# EAGLE schematic electronic_load (EAGLE 7.3.0)

## Sheet 1 of 2
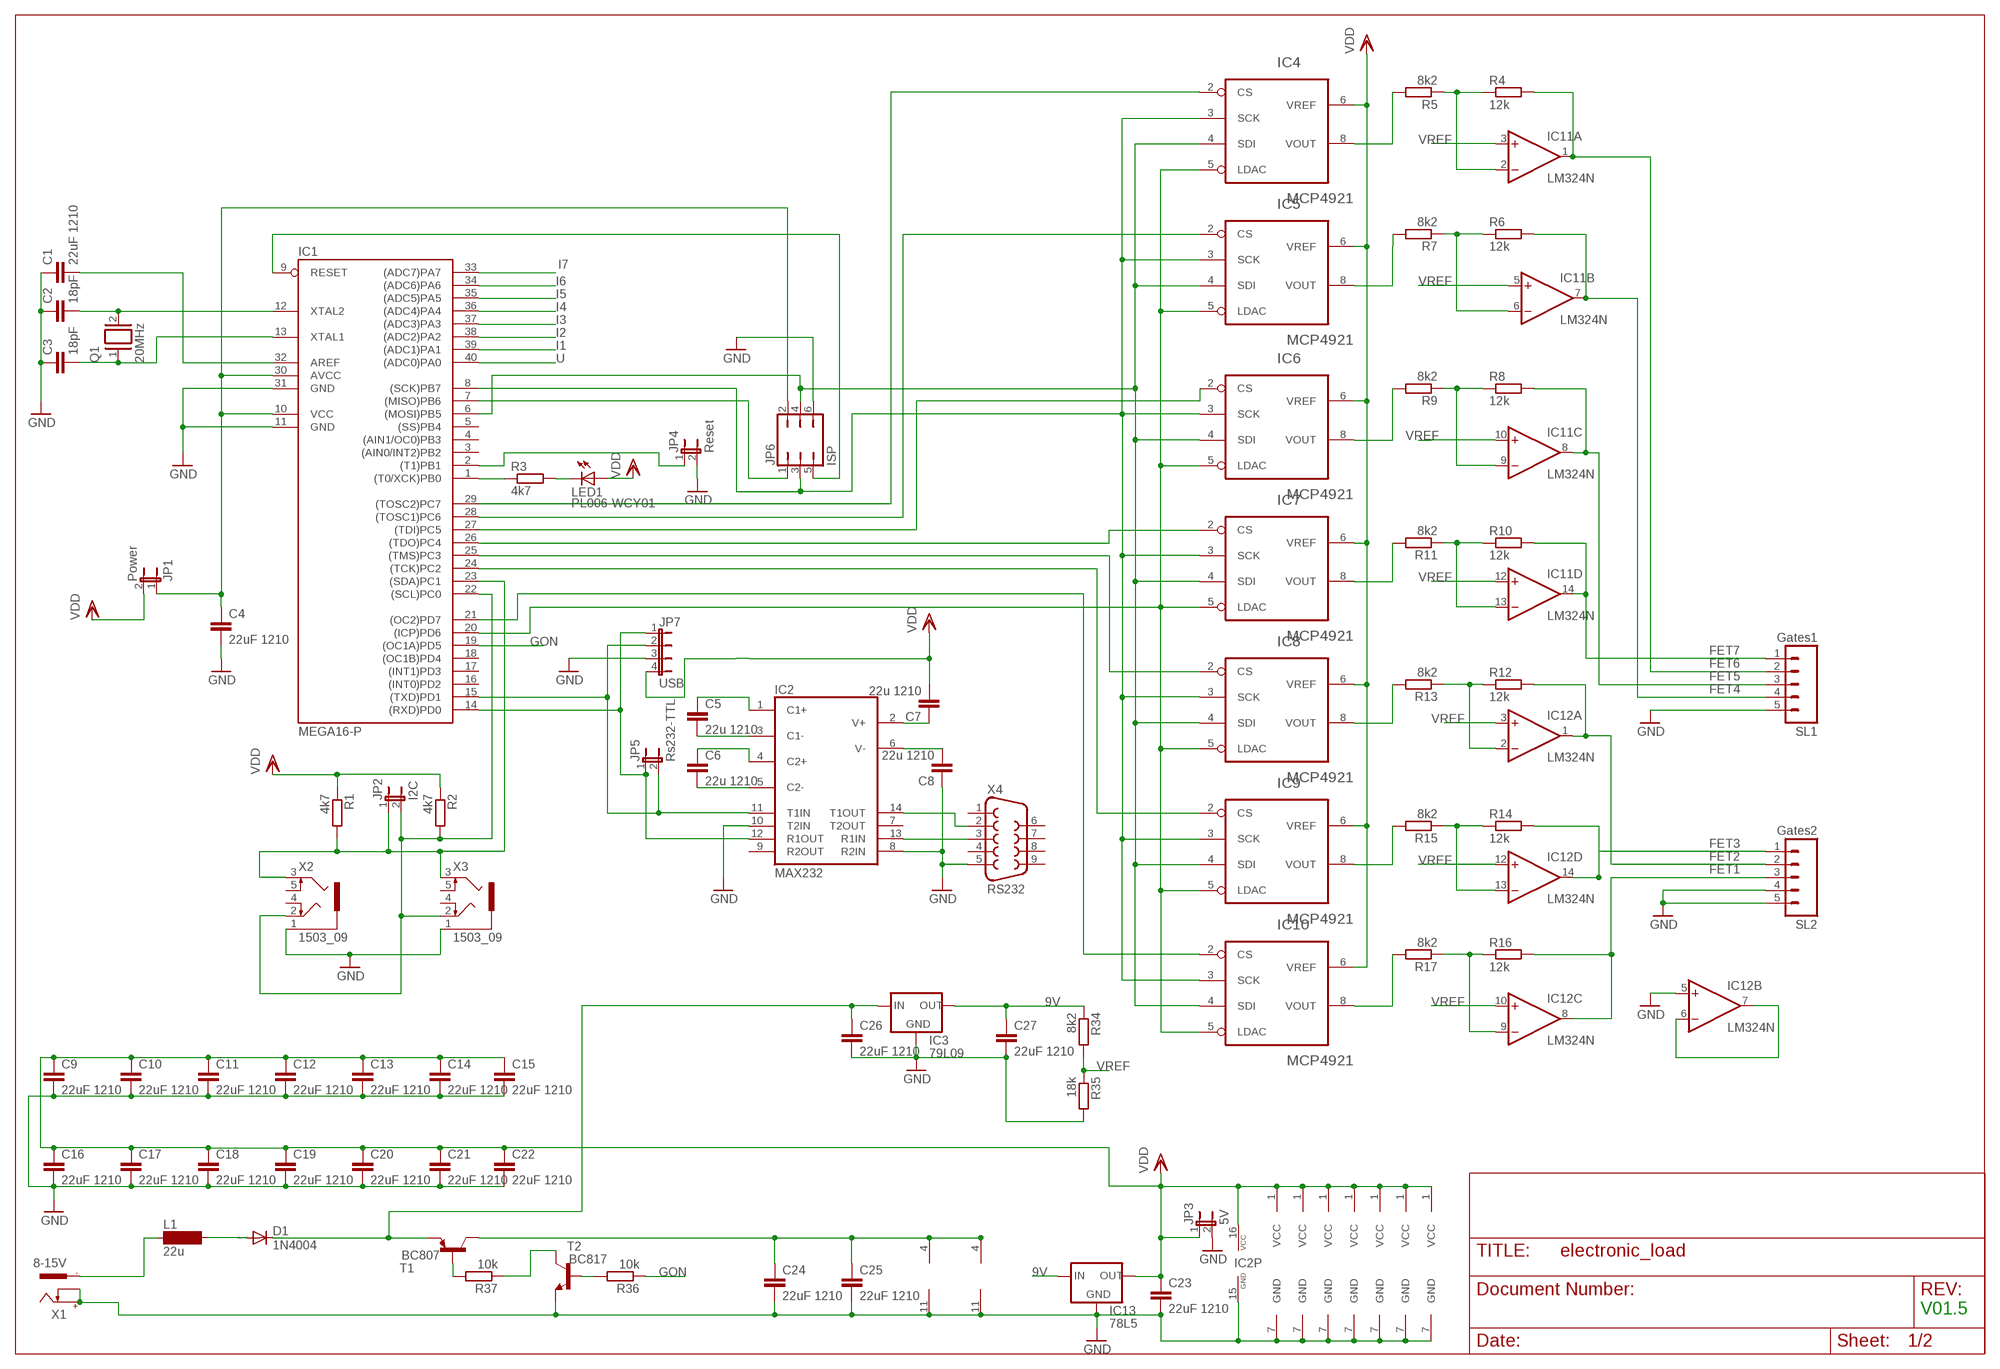
[diagram p0: schematic, sheet 1]

### Parts
C1  22uF 1210  C-EUC1206  [C1206]
C2  18pF  C-EU025-025X050  [C025-025X050]
C3  18pF  C-EU025-025X050  [C025-025X050]
C4  22uF 1210  C-EUC1206  [C1206]
C5  22u 1210  C-EUC1206  [C1206]
C6  22u 1210  C-EUC1206  [C1206]
C7  22u 1210  C-EUC1206  [C1206]
C8  22u 1210  C-EUC1206  [C1206]
C9  22uF 1210  C-EUC1206  [C1206]
C10  22uF 1210  C-EUC1206  [C1206]
C11  22uF 1210  C-EUC1206  [C1206]
C12  22uF 1210  C-EUC1206  [C1206]
C13  22uF 1210  C-EUC1206  [C1206]
C14  22uF 1210  C-EUC1206  [C1206]
C15  22uF 1210  C-EUC1206  [C1206]
C16  22uF 1210  C-EUC1206  [C1206]
C17  22uF 1210  C-EUC1206  [C1206]
C18  22uF 1210  C-EUC1206  [C1206]
C19  22uF 1210  C-EUC1206  [C1206]
C20  22uF 1210  C-EUC1206  [C1206]
C21  22uF 1210  C-EUC1206  [C1206]
C22  22uF 1210  C-EUC1206  [C1206]
C23  22uF 1210  C-EUC1206  [C1206]
C24  22uF 1210  C-EUC1206  [C1206]
C25  22uF 1210  C-EUC1206  [C1206]
C26  22uF 1210  C-EUC1206  [C1206]
C27  22uF 1210  C-EUC1206  [C1206]
D1  1N4004  [DO41-10]
IC1  MEGA16-P  [DIL40]
IC2  MAX232  [DIL16]
IC3  79L09  78LXX  [78LXX]
IC4  MCP4921  MCP491  [DIL08]
IC5  MCP4921  MCP491  [DIL08]
IC6  MCP4921  MCP491  [DIL08]
IC7  MCP4921  MCP491  [DIL08]
IC8  MCP4921  MCP491  [DIL08]
IC9  MCP4921  MCP491  [DIL08]
IC10  MCP4921  MCP491  [DIL08]
IC11  LM324N  [DIL14]
IC12  LM324N  [DIL14]
IC13  78L5  78LXX  [78LXX]
JP1  Power  JP1E  [JP1]
JP2  I2C  JP1E  [JP1]
JP3  5V  JP1E  [JP1]
JP4  Reset  JP1E  [JP1]
JP5  Rs232-TTL  JP1E  [JP1]
JP6  ISP  JP3Q  [JP3Q]
JP7  USB  JP4E  [JP4]
L1  22u  MS85  [MS85]
LED1  PL006-WCY01  [SOT23]
Q1  20MHz  XTAL/S  [QS]
R1  4k7  R-EU_0207/2V  [0207/2V]
R2  4k7  R-EU_0207/2V  [0207/2V]
R3  4k7  R-EU_R1206  [R1206]
R4  12k  R-EU_R1206  [R1206]
R5  8k2  R-EU_R1206  [R1206]
R6  12k  R-EU_R1206  [R1206]
R7  8k2  R-EU_R1206  [R1206]
R8  12k  R-EU_R1206  [R1206]
R9  8k2  R-EU_R1206  [R1206]
R10  12k  R-EU_R1206  [R1206]
R11  8k2  R-EU_R1206  [R1206]
R12  12k  R-EU_R1206  [R1206]
R13  8k2  R-EU_R1206  [R1206]
R14  12k  R-EU_R1206  [R1206]
R15  8k2  R-EU_R1206  [R1206]
R16  12k  R-EU_R1206  [R1206]
R17  8k2  R-EU_R1206  [R1206]
R34  8k2  R-EU_R1206  [R1206]
R35  18k  R-EU_R1206  [R1206]
R36  10k  R-EU_R1206  [R1206]
R37  10k  R-EU_R1206  [R1206]
SL1  Gates1  M05  [05P]
SL2  Gates2  M05  [05P]
T1  BC807  BC807-16-PNP-SOT23-BEC  [SOT23-BEC]
T2  BC817  BC817-16-NPN-SOT23-BEC  [SOT23-BEC]
X1  8-15V  737992-55  [737992-5]
X2  1503_09  [1503_09]
X3  1503_09  [1503_09]
X4  RS232  F09H  [F09H]

### Nets
9V: C27.1 IC3.OUT IC13.IN R34.1
C13: C5.1 IC2.1(C1+)
FET1: IC12.8(C:OUT) R16.2 SL2.3
FET2: IC12.1(A:OUT) R12.2 SL2.2
FET3: IC12.14(D:OUT) R14.2 SL2.1
FET4: IC11.7(B:OUT) R6.2 SL1.4
FET5: IC11.8(C:OUT) R8.2 SL1.3
FET6: IC11.1(A:OUT) R4.2 SL1.2
FET7: IC11.14(D:OUT) R10.2 SL1.1
GND: C1.1 C2.1 C3.1 C4.2 C8.1 C9.2 C10.2 C11.2 C12.2 C13.2 C14.2 C15.2 C16.2 C17.2 C18.2 C19.2 C20.2 C21.2 C22.2 C23.2 C24.2 C25.2 C26.2 C27.2 IC1.11(GND) IC1.31(GND) IC2.8(R2IN) IC2.10(T2IN) IC2.15(GND) IC3.GND IC4.7(GND) IC5.7(GND) IC6.7(GND) IC7.7(GND) IC8.7(GND) IC9.7(GND) IC10.7(GND) IC11.11(P:V-) IC12.5(B:+IN) IC12.11(P:V-) IC13.GND JP3.2 JP4.2 JP6.6 JP7.3 R35.2 SL1.5 SL2.4 SL2.5 T2.E X1.+ X1.K X2.1 X3.1 X4.5 ; also sheet 2
GON: IC1.19((OC1A)PD5) R36.1
I1: IC1.39((ADC1)PA1) ; also sheet 2
I2: IC1.38((ADC2)PA2) ; also sheet 2
I3: IC1.37((ADC3)PA3) ; also sheet 2
I4: IC1.36((ADC4)PA4) ; also sheet 2
I5: IC1.35((ADC5)PA5) ; also sheet 2
I6: IC1.34((ADC6)PA6) ; also sheet 2
I7: IC1.33((ADC7)PA7) ; also sheet 2
N$2: IC1.14((RXD)PD0) IC2.12(R1OUT) JP5.1 JP7.1
N$3: C6.2 IC2.5(C2-)
N$4: IC1.21((OC2)PD7) IC10.2(CS)
N$5: IC1.23((SDA)PC1) JP2.1 R1.2 X2.3 X3.3
N$6: IC1.15((TXD)PD1) IC2.11(T1IN) JP5.2 JP7.2
N$7: L1.1 X1.-1
N$8: IC1.24((TCK)PC2) IC9.2(CS)
N$9: IC2.13(R1IN) X4.3
N$10: IC6.8(VOUT) R9.2
N$11: IC1.20((ICP)PD6) IC4.5(LDAC) IC5.5(LDAC) IC6.5(LDAC) IC7.5(LDAC) IC8.5(LDAC) IC9.5(LDAC) IC10.5(LDAC)
N$12: D1.A L1.2
N$13: C6.1 IC2.4(C2+)
N$14: C5.2 IC2.3(C1-)
N$15: IC1.7((MISO)PB6) JP6.1
N$16: C7.1 IC2.2(V+)
N$17: C8.2 IC2.6(V-)
N$18: IC1.9(RESET) JP6.5
N$19: C2.2 IC1.12(XTAL2) Q1.2
N$20: IC1.6((MOSI)PB5) IC4.4(SDI) IC5.4(SDI) IC6.4(SDI) IC7.4(SDI) IC8.4(SDI) IC9.4(SDI) IC10.4(SDI) JP6.4
N$21: IC7.8(VOUT) R11.2
N$22: IC1.22((SCL)PC0) JP2.2 R2.2 X2.2 X3.2
N$23: IC1.25((TMS)PC3) IC8.2(CS)
N$24: IC8.8(VOUT) R13.2
N$25: C4.1 IC1.10(VCC) IC1.30(AVCC) JP1.1 JP6.2
N$26: IC9.8(VOUT) R15.2
N$28: IC1.8((SCK)PB7) IC4.3(SCK) IC5.3(SCK) IC6.3(SCK) IC7.3(SCK) IC8.3(SCK) IC9.3(SCK) IC10.3(SCK) JP6.3
N$31: IC4.8(VOUT) R5.2
N$33: IC2.14(T1OUT) X4.2
N$35: C1.2 IC1.32(AREF)
N$36: IC11.13(D:-IN) R10.1 R11.1
N$37: C3.2 IC1.13(XTAL1) Q1.1
N$38: IC11.9(C:-IN) R8.1 R9.1
N$39: IC10.8(VOUT) R17.2
N$40: IC12.13(D:-IN) R14.1 R15.1
N$42: IC1.1((T0/XCK)PB0) R3.1
N$43: LED1.3(C) R3.2
N$46: IC1.2((T1)PB1) JP4.1
N$50: IC1.29((TOSC2)PC7) IC4.2(CS)
N$51: IC1.26((TDO)PC4) IC7.2(CS)
N$55: IC5.8(VOUT) R7.2
N$56: C26.1 D1.C IC3.IN T1.E
N$57: IC12.2(A:-IN) R12.1 R13.1
N$58: IC12.9(C:-IN) R16.1 R17.1
N$59: C24.1 C25.1 IC11.4(P:V+) IC12.4(P:V+) T1.C
N$61: R37.2 T1.B
N$62: IC1.28((TOSC1)PC6) IC5.2(CS)
N$63: R37.1 T2.C
N$64: R36.2 T2.B
N$71: IC1.27((TDI)PC5) IC6.2(CS)
N$73: IC11.6(B:-IN) R6.1 R7.1
N$91: IC11.2(A:-IN) R4.1 R5.1
N$96: IC12.6(B:-IN) IC12.7(B:OUT)
U: IC1.40((ADC0)PA0) ; also sheet 2
VDD: C7.2 C9.1 C10.1 C11.1 C12.1 C13.1 C14.1 C15.1 C16.1 C17.1 C18.1 C19.1 C20.1 C21.1 C22.1 C23.1 IC2.16(VCC) IC4.1(VCC) IC4.6(VREF) IC5.1(VCC) IC5.6(VREF) IC6.1(VCC) IC6.6(VREF) IC7.1(VCC) IC7.6(VREF) IC8.1(VCC) IC8.6(VREF) IC9.1(VCC) IC9.6(VREF) IC10.1(VCC) IC10.6(VREF) IC13.OUT JP1.2 JP3.1 JP7.4 LED1.1(A) R1.1 R2.1 ; also sheet 2
VREF: IC11.3(A:+IN) IC11.5(B:+IN) IC11.10(C:+IN) IC11.12(D:+IN) IC12.3(A:+IN) IC12.10(C:+IN) IC12.12(D:+IN) R34.2 R35.1
Unconnected: IC1.3((AIN0/INT2)PB2) IC1.4((AIN1/OC0)PB3) IC1.5((SS)PB4) IC1.16((INT0)PD2) IC1.17((INT1)PD3) IC1.18((OC1B)PD4) IC2.7(T2OUT) IC2.9(R2OUT) X1.-2 X2.4 X2.5 X3.4 X3.5 X4.1 X4.4 X4.6 X4.7 X4.8 X4.9

### Notes on the sheet
- V01.5

## Sheet 2 of 2
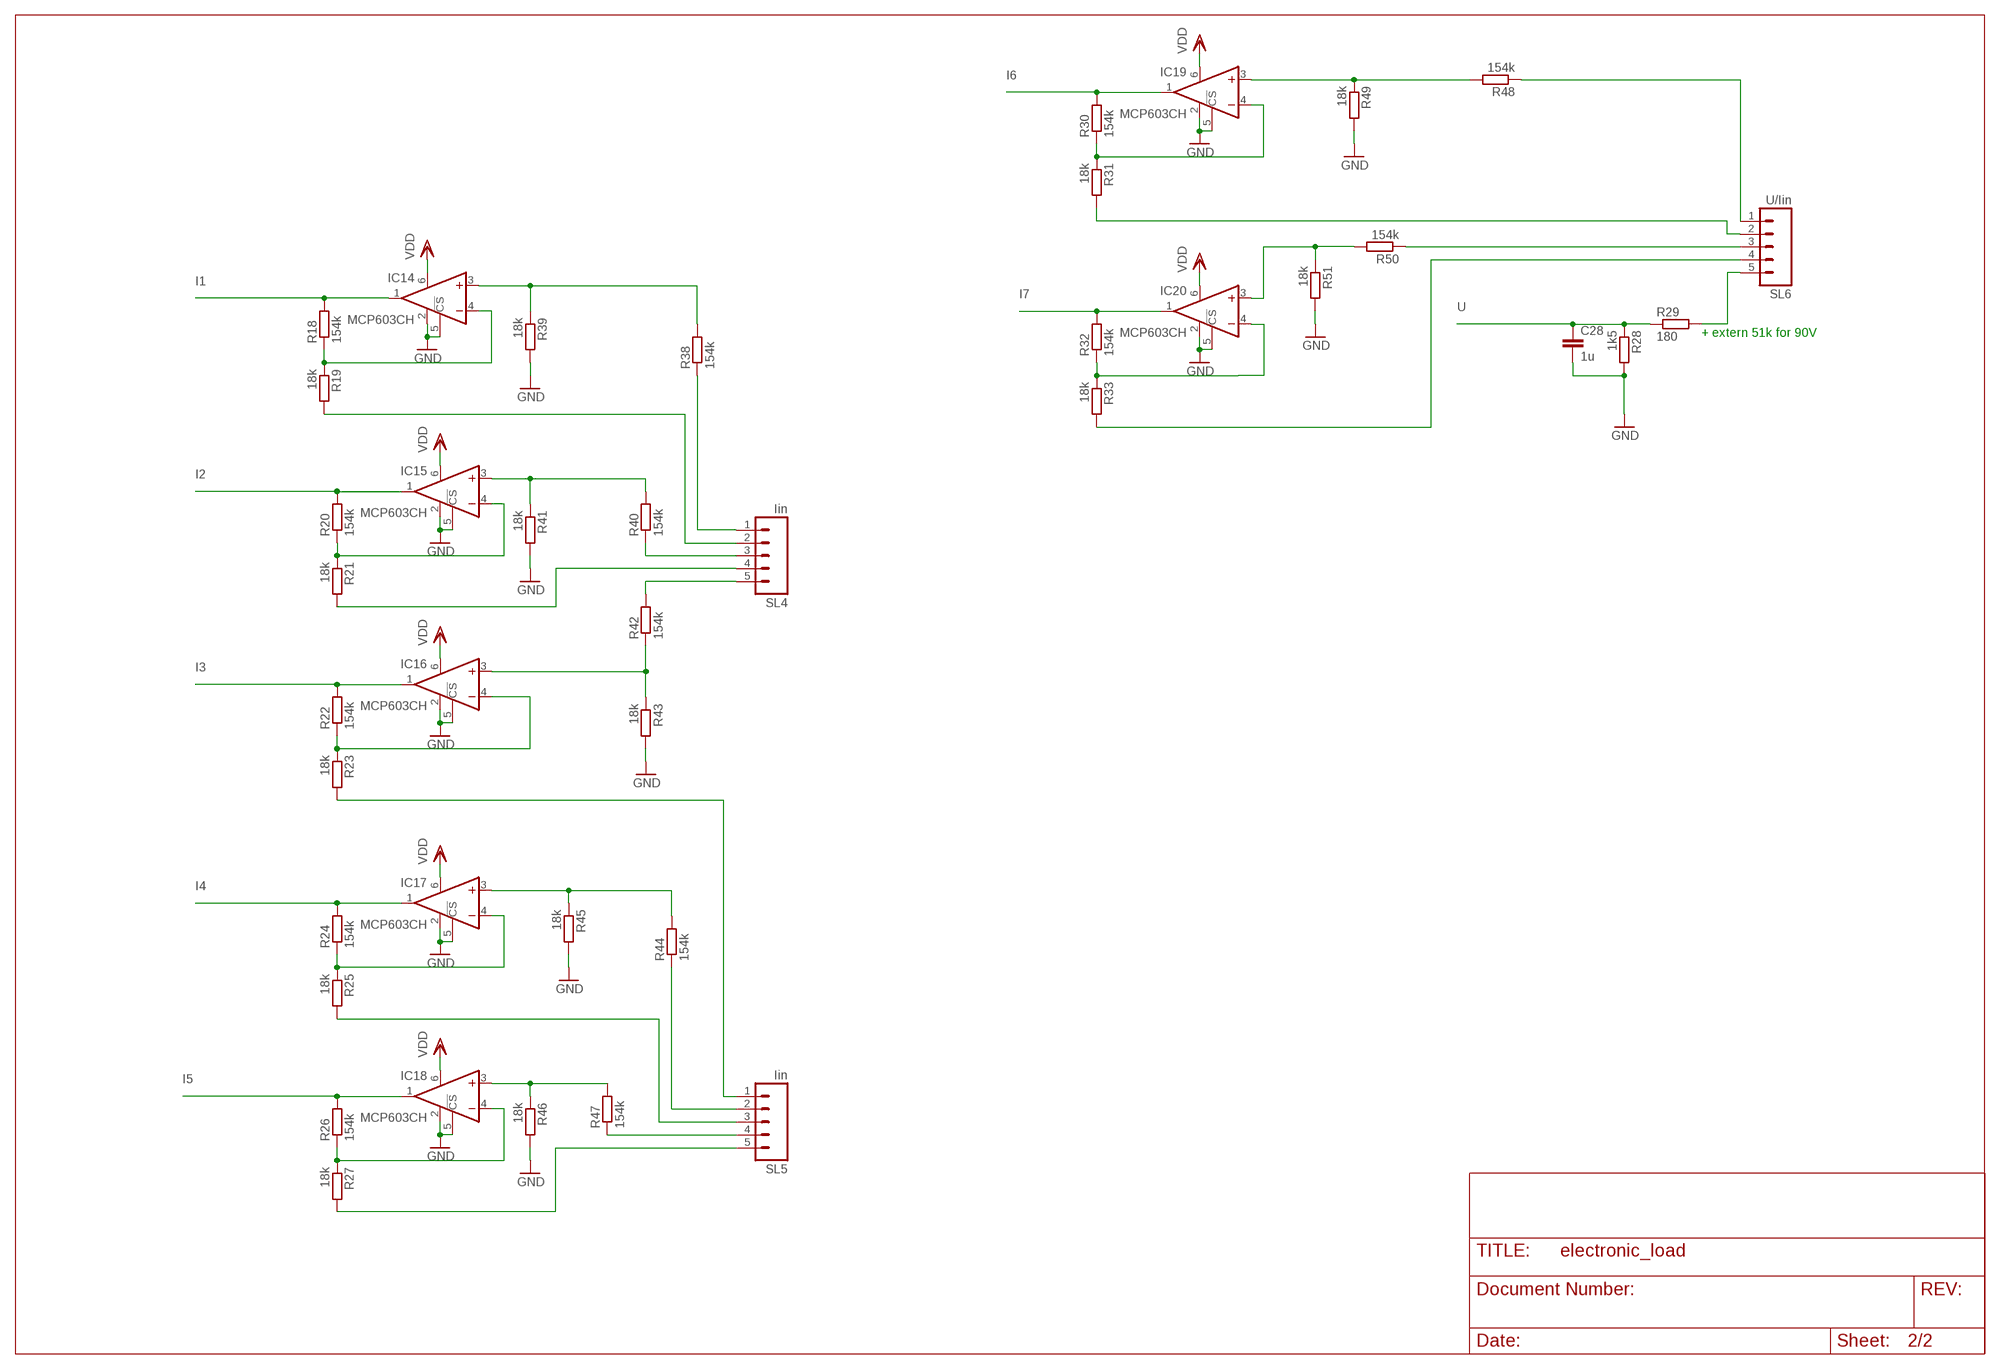
[diagram p1: schematic, sheet 2]

### Parts
C28  1u  C-EUC1206  [C1206]
IC14  MCP603CH  [SOT23-6]
IC15  MCP603CH  [SOT23-6]
IC16  MCP603CH  [SOT23-6]
IC17  MCP603CH  [SOT23-6]
IC18  MCP603CH  [SOT23-6]
IC19  MCP603CH  [SOT23-6]
IC20  MCP603CH  [SOT23-6]
R18  154k  R-EU_0207/2V  [0207/2V]
R19  18k  R-EU_0207/2V  [0207/2V]
R20  154k  R-EU_0207/2V  [0207/2V]
R21  18k  R-EU_0207/2V  [0207/2V]
R22  154k  R-EU_0207/2V  [0207/2V]
R23  18k  R-EU_0207/2V  [0207/2V]
R24  154k  R-EU_0207/2V  [0207/2V]
R25  18k  R-EU_0207/2V  [0207/2V]
R26  154k  R-EU_0207/2V  [0207/2V]
R27  18k  R-EU_0207/2V  [0207/2V]
R28  1k5  R-EU_R1206  [R1206]
R29  180  R-EU_R1206  [R1206]
R30  154k  R-EU_0207/2V  [0207/2V]
R31  18k  R-EU_0207/2V  [0207/2V]
R32  154k  R-EU_0207/2V  [0207/2V]
R33  18k  R-EU_0207/2V  [0207/2V]
R38  154k  R-EU_0207/2V  [0207/2V]
R39  18k  R-EU_0207/2V  [0207/2V]
R40  154k  R-EU_0207/2V  [0207/2V]
R41  18k  R-EU_0207/2V  [0207/2V]
R42  154k  R-EU_0207/2V  [0207/2V]
R43  18k  R-EU_0207/2V  [0207/2V]
R44  154k  R-EU_0207/2V  [0207/2V]
R45  18k  R-EU_0207/2V  [0207/2V]
R46  18k  R-EU_0207/2V  [0207/2V]
R47  154k  R-EU_0207/2V  [0207/2V]
R48  154k  R-EU_0207/2V  [0207/2V]
R49  18k  R-EU_0207/2V  [0207/2V]
R50  154k  R-EU_0207/2V  [0207/2V]
R51  18k  R-EU_0207/2V  [0207/2V]
SL4  Iin  M05  [05P]
SL5  Iin  M05  [05P]
SL6  U/Iin  M05  [05P]

### Nets
GND: C28.2 IC14.2(V-) IC14.5(!CS) IC15.2(V-) IC15.5(!CS) IC16.2(V-) IC16.5(!CS) IC17.2(V-) IC17.5(!CS) IC18.2(V-) IC18.5(!CS) IC19.2(V-) IC19.5(!CS) IC20.2(V-) IC20.5(!CS) R28.2 R39.2 R41.2 R43.2 R45.2 R46.2 R49.2 R51.2 ; also sheet 1
I1: IC14.1(OUT) R18.2 ; also sheet 1
I2: IC15.1(OUT) R20.2 ; also sheet 1
I3: IC16.1(OUT) R22.2 ; also sheet 1
I4: IC17.1(OUT) R24.2 ; also sheet 1
I5: IC18.1(OUT) R26.2 ; also sheet 1
I6: IC19.1(OUT) R30.2 ; also sheet 1
I7: IC20.1(OUT) R32.2 ; also sheet 1
N$1: IC14.4(-IN) R18.1 R19.1
N$27: R29.2 SL6.5
N$29: R21.2 SL4.4
N$30: IC15.4(-IN) R20.1 R21.1
N$32: IC20.4(-IN) R32.1 R33.1
N$34: IC19.4(-IN) R30.1 R31.1
N$41: IC16.4(-IN) R22.1 R23.1
N$44: IC17.3(+IN) R44.2 R45.1
N$45: IC17.4(-IN) R24.1 R25.1
N$47: IC18.4(-IN) R26.1 R27.1
N$48: R47.1 SL5.4
N$49: IC15.3(+IN) R40.2 R41.1
N$52: R48.1 SL6.1
N$53: R31.2 SL6.2
N$54: R25.2 SL5.3
N$60: R27.2 SL5.5
N$65: R38.1 SL4.1
N$66: R40.1 SL4.3
N$67: IC14.3(+IN) R38.2 R39.1
N$68: R42.2 SL4.5
N$69: R19.2 SL4.2
N$70: R44.1 SL5.2
N$72: IC18.3(+IN) R46.1 R47.2
N$74: IC19.3(+IN) R48.2 R49.1
N$76: R50.1 SL6.3
N$79: R23.2 SL5.1
N$80: IC16.3(+IN) R42.1 R43.1
N$89: R33.2 SL6.4
N$90: IC20.3(+IN) R50.2 R51.1
U: C28.1 R28.1 R29.1 ; also sheet 1
VDD: IC14.6(V+) IC15.6(V+) IC16.6(V+) IC17.6(V+) IC18.6(V+) IC19.6(V+) IC20.6(V+) ; also sheet 1

### Notes on the sheet
- + extern 51k for 90V

## Library data of the parts
C1 C4-C27 = rcl:C-EU: CAPACITOR, European symbol
C2 C3 C28 = resistor:C-EU: CAPACITOR, European symbol
D1 = diode:1N4004: DIODE general purpose rectifier, 1 A
IC1 = atmel:MEGA16-P: MICROCONTROLLER 16 Kbytes FLASH 1 kbytes SRAM 512 bytes EEPROM USART 8-channel 10 bit ADC Source: avr.lbr; MPN: ATMEGA16-16PU; OC_FARNELL: 9171142; OC_NEWARK: 01M6885
IC2 = maxim:MAX232: RS232 TRANSCEIVER; MF: MAXIM; MPN: MAX232ACPE+; OC_FARNELL: 9723773; OC_NEWARK: 68K4544
IC3 IC13 = v-reg:78LXX: VOLTAGE REGULATOR
IC4-IC10 = dac:MCP49*1: Digital-to-Analog Converter
IC11 IC12 = linear:LM324: OP AMP
IC14-IC20 = linear:MCP603: Dual Op Amp 2.7V to 6.0V Single Supply CMOS Source: http://ww1.microchip.com/downloads/en/DeviceDoc/21314g.pdf
JP1-JP5 = jumper:JP1E: JUMPER
JP6 = jumper:JP3Q: JUMPER
JP7 = jumper:JP4E: JUMPER
L1 = inductor-neosid:MS85: INDUCTOR SMD power inductor; OC_FARNELL: unknown; OC_NEWARK: unknown
LED1 = led:PL006*: PLH006 Series SMD LED SOT23 PLH006-WCR21 Super Red PLH006-WCR12 High Eff Red PLH006-WCG13 Green PLH006-WCY01 Yellow www.p-tec.net Source: http://www.wittig-electronic.de/PTEC/PL006Series.pdf
Q1 = special:XTAL/S: CRYSTAL
R1-R51 = resistor:R-EU_: RESISTOR, European symbol
SL1 SL2 SL4-SL6 = con-amp-quick:M05: AMP QUICK CONNECTOR; OC_FARNELL: unknown; OC_NEWARK: unknown
T1 = transistor:*-PNP-: PNP Transistror
T2 = transistor:*-NPN-: NPN Transistror BF959 corrected 2008.03.06
X1 = con-conrad:737992-55: FEMALE PRINT CONNECTOR DIN 45323 (34V/3A), ROKA, distributor Conrad
X2 X3 = con-lumberg:1503_09: Jack connectors according to JISC 6560, 3.5 mm Klinkeneinbaukupplung nach JISC 6560, 3,5 mm, 3-polig/ stereo, abgewinkelte Ausführung, mit 2 Öffnern und Lötaugen, für Leiterplatten Rückseitenmontage Source: http://www.lumberg.com/Produkte/PDFs/1503_09.pdf; OC_FARNELL: 1243244; OC_NEWARK: unknown
X4 = con-subd:F09: SUB-D; OC_FARNELL: unknown; OC_NEWARK: unknown